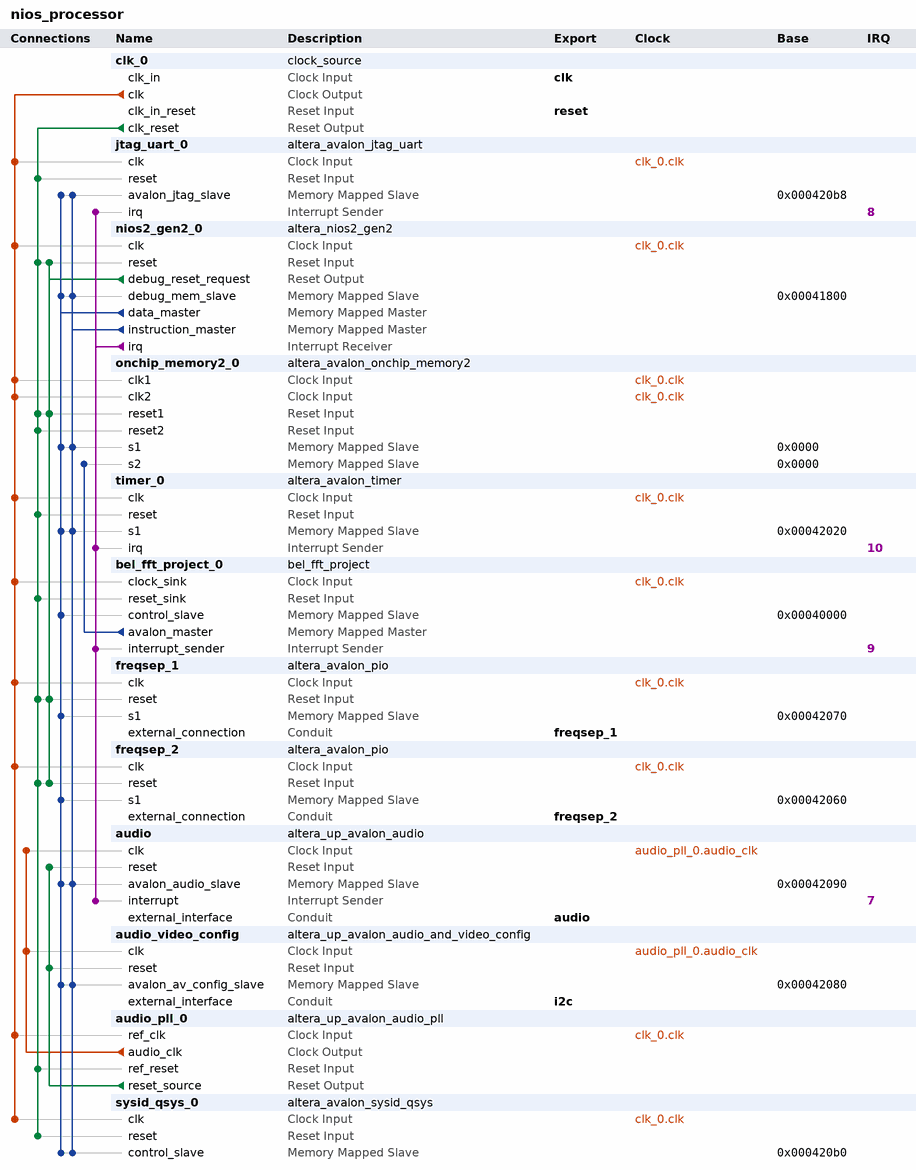
[diagram p0: system contents]
# Platform Designer (Qsys) system nios_processor, Cyclone IV E EP4CE115F29C7
# Parameters at their usual value, and those the tool derives, are not listed.
package require -exact qsys 16.1
create_system nios_processor
set_project_property DEVICE_FAMILY {Cyclone IV E}
set_project_property DEVICE EP4CE115F29C7

add_instance clk_0 clock_source 16.1
set_instance_parameter_value clk_0 clockFrequency 50000000

add_instance jtag_uart_0 altera_avalon_jtag_uart 16.1
set_instance_parameter_value jtag_uart_0 simInteractiveOptions NO_INTERACTIVE_WINDOWS

add_instance nios2_gen2_0 altera_nios2_gen2 16.1
set_instance_parameter_value nios2_gen2_0 dcache_size 2048
set_instance_parameter_value nios2_gen2_0 exceptionSlave onchip_memory2_0.s1
set_instance_parameter_value nios2_gen2_0 icache_size 4096
set_instance_parameter_value nios2_gen2_0 impl Tiny
set_instance_parameter_value nios2_gen2_0 resetSlave onchip_memory2_0.s1

add_instance onchip_memory2_0 altera_avalon_onchip_memory2 16.1
set_instance_parameter_value onchip_memory2_0 dataWidth 32
set_instance_parameter_value onchip_memory2_0 dualPort true
set_instance_parameter_value onchip_memory2_0 initMemContent true
set_instance_parameter_value onchip_memory2_0 initializationFileName onchip_mem.hex
set_instance_parameter_value onchip_memory2_0 memorySize 200000

add_instance timer_0 altera_avalon_timer 16.1
set_instance_parameter_value timer_0 period 1
set_instance_parameter_value timer_0 periodUnits MSEC

add_instance bel_fft_project_0 bel_fft_project 1.0

add_instance freqsep_1 altera_avalon_pio 16.1
set_instance_parameter_value freqsep_1 direction Output
set_instance_parameter_value freqsep_1 width 24

add_instance freqsep_2 altera_avalon_pio 16.1
set_instance_parameter_value freqsep_2 direction Output
set_instance_parameter_value freqsep_2 width 24

add_instance audio altera_up_avalon_audio 16.1
set_instance_parameter_value audio audio_in true
set_instance_parameter_value audio avalon_bus_type {Memory Mapped}
set_instance_parameter_value audio dw 16

add_instance audio_video_config altera_up_avalon_audio_and_video_config 16.1
set_instance_parameter_value audio_video_config audio_in {Line In to ADC}
set_instance_parameter_value audio_video_config bit_length 16
set_instance_parameter_value audio_video_config board DE2-115
set_instance_parameter_value audio_video_config dac_enable false
set_instance_parameter_value audio_video_config line_in_bypass true
set_instance_parameter_value audio_video_config sampling_rate {32 kHz}
set_instance_parameter_value audio_video_config video_format PAL

add_instance audio_pll_0 altera_up_avalon_audio_pll 16.1
set_instance_parameter_value audio_pll_0 gui_refclk 50.0

add_instance sysid_qsys_0 altera_avalon_sysid_qsys 16.1
set_instance_parameter_value sysid_qsys_0 id 229490415

# connections
add_connection audio_pll_0.audio_clk audio.clk clock
add_connection audio_pll_0.audio_clk audio_video_config.clk clock
add_connection clk_0.clk audio_pll_0.ref_clk clock
add_connection clk_0.clk bel_fft_project_0.clock_sink clock
add_connection clk_0.clk freqsep_1.clk clock
add_connection clk_0.clk freqsep_2.clk clock
add_connection clk_0.clk jtag_uart_0.clk clock
add_connection clk_0.clk nios2_gen2_0.clk clock
add_connection clk_0.clk onchip_memory2_0.clk1 clock
add_connection clk_0.clk onchip_memory2_0.clk2 clock
add_connection clk_0.clk sysid_qsys_0.clk clock
add_connection clk_0.clk timer_0.clk clock
add_connection audio_pll_0.reset_source audio.reset reset
add_connection audio_pll_0.reset_source audio_video_config.reset reset
add_connection clk_0.clk_reset audio_pll_0.ref_reset reset
add_connection clk_0.clk_reset bel_fft_project_0.reset_sink reset
add_connection clk_0.clk_reset freqsep_1.reset reset
add_connection clk_0.clk_reset freqsep_2.reset reset
add_connection clk_0.clk_reset jtag_uart_0.reset reset
add_connection clk_0.clk_reset nios2_gen2_0.reset reset
add_connection clk_0.clk_reset onchip_memory2_0.reset1 reset
add_connection clk_0.clk_reset onchip_memory2_0.reset2 reset
add_connection clk_0.clk_reset sysid_qsys_0.reset reset
add_connection clk_0.clk_reset timer_0.reset reset
add_connection nios2_gen2_0.debug_reset_request freqsep_1.reset reset
add_connection nios2_gen2_0.debug_reset_request freqsep_2.reset reset
add_connection nios2_gen2_0.debug_reset_request nios2_gen2_0.reset reset
add_connection nios2_gen2_0.debug_reset_request onchip_memory2_0.reset1 reset
add_connection bel_fft_project_0.avalon_master onchip_memory2_0.s2 avalon
set_connection_parameter_value bel_fft_project_0.avalon_master/onchip_memory2_0.s2 baseAddress 0x0000
add_connection nios2_gen2_0.data_master audio.avalon_audio_slave avalon
set_connection_parameter_value nios2_gen2_0.data_master/audio.avalon_audio_slave baseAddress 0x00042090
add_connection nios2_gen2_0.data_master audio_video_config.avalon_av_config_slave avalon
set_connection_parameter_value nios2_gen2_0.data_master/audio_video_config.avalon_av_config_slave baseAddress 0x00042080
add_connection nios2_gen2_0.data_master bel_fft_project_0.control_slave avalon
set_connection_parameter_value nios2_gen2_0.data_master/bel_fft_project_0.control_slave baseAddress 0x00040000
add_connection nios2_gen2_0.data_master freqsep_1.s1 avalon
set_connection_parameter_value nios2_gen2_0.data_master/freqsep_1.s1 baseAddress 0x00042070
add_connection nios2_gen2_0.data_master freqsep_2.s1 avalon
set_connection_parameter_value nios2_gen2_0.data_master/freqsep_2.s1 baseAddress 0x00042060
add_connection nios2_gen2_0.data_master jtag_uart_0.avalon_jtag_slave avalon
set_connection_parameter_value nios2_gen2_0.data_master/jtag_uart_0.avalon_jtag_slave baseAddress 0x000420b8
add_connection nios2_gen2_0.data_master nios2_gen2_0.debug_mem_slave avalon
set_connection_parameter_value nios2_gen2_0.data_master/nios2_gen2_0.debug_mem_slave baseAddress 0x00041800
add_connection nios2_gen2_0.data_master onchip_memory2_0.s1 avalon
set_connection_parameter_value nios2_gen2_0.data_master/onchip_memory2_0.s1 baseAddress 0x0000
add_connection nios2_gen2_0.data_master sysid_qsys_0.control_slave avalon
set_connection_parameter_value nios2_gen2_0.data_master/sysid_qsys_0.control_slave baseAddress 0x000420b0
add_connection nios2_gen2_0.data_master timer_0.s1 avalon
set_connection_parameter_value nios2_gen2_0.data_master/timer_0.s1 baseAddress 0x00042020
add_connection nios2_gen2_0.instruction_master audio.avalon_audio_slave avalon
set_connection_parameter_value nios2_gen2_0.instruction_master/audio.avalon_audio_slave baseAddress 0x00042090
add_connection nios2_gen2_0.instruction_master audio_video_config.avalon_av_config_slave avalon
set_connection_parameter_value nios2_gen2_0.instruction_master/audio_video_config.avalon_av_config_slave baseAddress 0x00042080
add_connection nios2_gen2_0.instruction_master jtag_uart_0.avalon_jtag_slave avalon
set_connection_parameter_value nios2_gen2_0.instruction_master/jtag_uart_0.avalon_jtag_slave baseAddress 0x000420b8
add_connection nios2_gen2_0.instruction_master nios2_gen2_0.debug_mem_slave avalon
set_connection_parameter_value nios2_gen2_0.instruction_master/nios2_gen2_0.debug_mem_slave baseAddress 0x00041800
add_connection nios2_gen2_0.instruction_master onchip_memory2_0.s1 avalon
set_connection_parameter_value nios2_gen2_0.instruction_master/onchip_memory2_0.s1 baseAddress 0x0000
add_connection nios2_gen2_0.instruction_master sysid_qsys_0.control_slave avalon
set_connection_parameter_value nios2_gen2_0.instruction_master/sysid_qsys_0.control_slave baseAddress 0x000420b0
add_connection nios2_gen2_0.instruction_master timer_0.s1 avalon
set_connection_parameter_value nios2_gen2_0.instruction_master/timer_0.s1 baseAddress 0x00042020
add_connection nios2_gen2_0.irq audio.interrupt interrupt
set_connection_parameter_value nios2_gen2_0.irq/audio.interrupt irqNumber 7
add_connection nios2_gen2_0.irq bel_fft_project_0.interrupt_sender interrupt
set_connection_parameter_value nios2_gen2_0.irq/bel_fft_project_0.interrupt_sender irqNumber 9
add_connection nios2_gen2_0.irq jtag_uart_0.irq interrupt
set_connection_parameter_value nios2_gen2_0.irq/jtag_uart_0.irq irqNumber 8
add_connection nios2_gen2_0.irq timer_0.irq interrupt
set_connection_parameter_value nios2_gen2_0.irq/timer_0.irq irqNumber 10

# exported interfaces
add_interface audio conduit end
set_interface_property audio EXPORT_OF audio.external_interface
add_interface clk clock sink
set_interface_property clk EXPORT_OF clk_0.clk_in
add_interface freqsep_1 conduit end
set_interface_property freqsep_1 EXPORT_OF freqsep_1.external_connection
add_interface freqsep_2 conduit end
set_interface_property freqsep_2 EXPORT_OF freqsep_2.external_connection
add_interface i2c conduit end
set_interface_property i2c EXPORT_OF audio_video_config.external_interface
add_interface reset reset sink
set_interface_property reset EXPORT_OF clk_0.clk_in_reset

set_interconnect_requirement {$system} qsys_mm.clockCrossingAdapter HANDSHAKE
set_interconnect_requirement {$system} qsys_mm.enableEccProtection FALSE
set_interconnect_requirement {$system} qsys_mm.insertDefaultSlave FALSE
set_interconnect_requirement {$system} qsys_mm.maxAdditionalLatency 1

save_system nios_processor.qsys
